# Altium schematic sheet Module RS485.SchDoc
size A
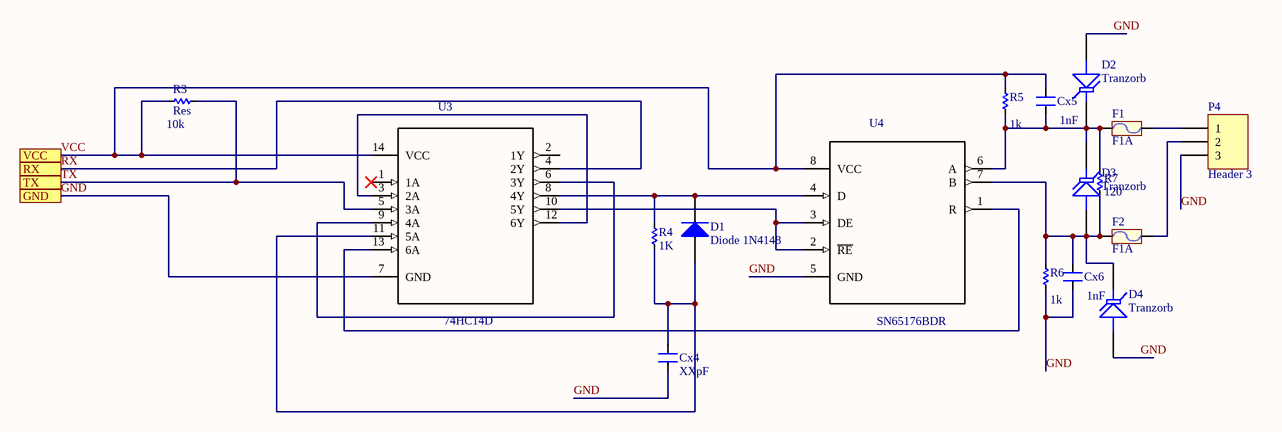
[diagram p0: Module RS485.SchDoc]

## Parts
Cx4  XXpF  [CN-SMD-1206]
Cx5  value 1nF  [CN-SMD-1206]
Cx6  value 1nF  [CN-SMD-1206]
D1  Diode 1N4148  [DO-35]
D2  Tranzorb  [DO-7]
D3  Tranzorb  [DO-7]
D4  Tranzorb  [DO-7]
F1  F1A  [Fuse3]
F2  F1A  [Fuse3]
P4  Header 3  [HDR1X3]
R3  Res  value 10k  [RES-SMD-1206]
R4  1K  [RES-SMD-1206]
R5  value 1k  [RES-SMD-1206]
R6  value 1k  [RES-SMD-1206]
R7  120  [RES-SMD-1206]
U3  74HC14D  [*SOIC127P600X175-14N]
U4  SN65176BDR  [*SOIC127P600X175-8N]

## Ports
GND, RX, TX, VCC

## Nets
GND: Cx4.1 Cx6.2 D2.1(A) D4.1(A) P4.3 R6.1 U3.7(GND) U4.5(GND) ; port GND
RX: U3.4(2Y) ; port RX
TX: R3.2 U3.5(3A) ; port TX
VCC: Cx5.1 R3.1 R5.2 U3.14(VCC) U4.8(VCC) ; port VCC
NetCx4_2: Cx4.2 D1.1(A) R4.2 U3.11(5A)
NetCx5_2: Cx5.2 D2.2(K) D3.2(K) F1.1 R5.1 R7.1 U4.6(A)
NetCx6_1: Cx6.1 D3.1(A) D4.2(K) F2.1 R6.2 R7.2 U4.7(B)
NetD1_2: D1.2(K) R4.1 U3.8(4Y) U4.4(D)
NetF1_2: F1.2 P4.1
NetF2_2: F2.2 P4.2
NetU3_3: U3.3(2A) U3.12(6Y)
NetU3_6: U3.6(3Y) U3.9(4A)
NetU3_10: U3.10(5Y) U4.2(~{RE}) U4.3(DE)
NetU3_13: U3.13(6A) U4.1(R)

Not connected (* = marked no-connect by the designer): U3 1(1A)* 2(1Y)

## Library data of the parts
Cx4 = CN: Value: 33pF
Cx5 Cx6 = CN
D1 = Diode 1N4148: High Conductance Fast Diode; Published: 8-Jun-2000; LatestRevisionDate: 17-Jul-2002; LatestRevisionNote: Re-released for DXP Platform.; DatasheetVersion: 1997; PackageReference: DO-35; Publisher: Altium Limited; PackageDescription: Diode, Axial; Body 3.8 x 1.9 mm (LxDia. max), Lead Dia. 0.53 mm (max); Code_JEDEC: DO-204-AH; ComponentLink1Description: Manufacturer Link; ComponentLink1URL: http://www.fairchildsemi.com/; ComponentLink2Description: Datasheet; ComponentLink2URL: http://www.fairchildsemi.com/ds/1N%2F1N4148.pdf
D2-D4 = Tranzorb: Transient Voltage Suppression (TVS) Diode; Published: 24-Mar-1999; LatestRevisionDate: 17-Jul-2002; LatestRevisionNote: Re-released for DXP Platform.; PackageReference: DO-7; Publisher: Altium Limited; PackageDescription: Axial Lead Diode
F1 F2 = Fuse: Designed by: VanDungEvn; Value: Fuse
P4 = Header 3: Header, 3-Pin; LatestRevisionDate: 17-Jul-2002; LatestRevisionNote: Re-released for DXP Platform.; Publisher: Altium Limited
R3-R7 = Res-SMD: Resistor; Manufacturer: Generic Components; Class: Passive; Published: 08/06/2000; Publisher: Altium Hobart Technology Centre
U3 = 74HC14D: 74HC CMOS logic IC series SOIC14 Hex Schmitt Inverter; MF: Toshiba Semiconductor; SnapEDA_Link: https://www.snapeda.com/parts/74HC14D/Toshiba%20Semiconductor%20and%20Storage/view-part/?ref=snap; Digi-Key_Part_Number: 74HC14DCT-ND; Digi-Key_Purchase_URL: https://www.digikey.vn/product-detail/en/toshiba-semiconductor-and-storage/74HC14D/74HC14DCT-ND/6109122?utm_source=snapeda&utm_medium=aggregator&utm_campaign=symbol; MP: 74HC14D; Package: SOIC-14 Toshiba; Value: *
U4 = SN65176BDR: Single Transmitter/Receiver RS-422/RS-485 8-Pin SOIC T/R; MF: Texas Instruments; MP: SN65176BDR; Digi-Key_Part_Number: 296-14636-1-ND; Package: SOIC-8 Texas Instruments; Digi-Key_Purchase_URL: https://www.digikey.vn/product-detail/en/texas-instruments/SN65176BDR/296-14636-1-ND/555935?utm_source=snapeda&utm_medium=aggregator&utm_campaign=symbol; SnapEDA_Link: https://www.snapeda.com/parts/SN65176BDR/Texas%20Instruments/view-part/?ref=snap; Value: *